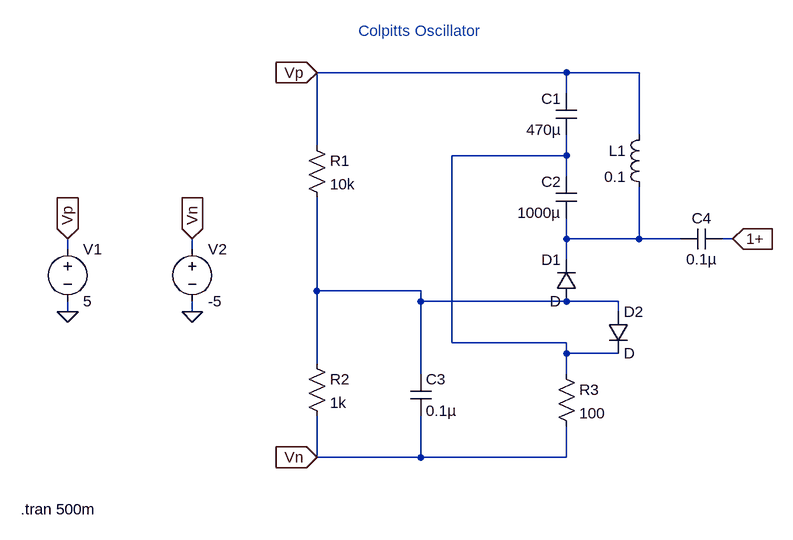
[diagram p0: schematic colpitts_osc_ltspice.asc]
colpitts_osc_ltspice.asc, the LTspice schematic file:
Version 4
SHEET 1 880 784
WIRE -208 -288 -592 -288
WIRE -96 -288 -208 -288
WIRE -208 -256 -208 -288
WIRE -96 -192 -96 -288
WIRE -592 -176 -592 -288
WIRE -208 -160 -208 -192
WIRE -208 -160 -384 -160
WIRE -208 -128 -208 -160
WIRE -208 -32 -208 -64
WIRE -96 -32 -96 -112
WIRE -96 -32 -208 -32
WIRE -32 -32 -96 -32
WIRE 48 -32 32 -32
WIRE -976 -16 -976 -32
WIRE -784 -16 -784 -32
WIRE -208 0 -208 -32
WIRE -592 48 -592 -96
WIRE -432 48 -592 48
WIRE -432 64 -432 48
WIRE -208 64 -432 64
WIRE -128 64 -208 64
WIRE -976 80 -976 64
WIRE -784 80 -784 64
WIRE -128 80 -128 64
WIRE -384 128 -384 -160
WIRE -208 128 -384 128
WIRE -208 144 -208 128
WIRE -128 144 -208 144
WIRE -592 160 -592 48
WIRE -432 176 -432 64
WIRE -208 176 -208 144
WIRE -592 304 -592 240
WIRE -432 304 -432 240
WIRE -432 304 -592 304
WIRE -208 304 -208 256
WIRE -208 304 -432 304
FLAG 48 -32 1+
IOPIN 48 -32 In
FLAG -592 -288 Vp
IOPIN -592 -288 In
FLAG -592 304 Vn
IOPIN -592 304 In
FLAG -976 80 0
FLAG -784 80 0
FLAG -976 -32 Vp
IOPIN -976 -32 In
FLAG -784 -32 Vn
IOPIN -784 -32 In
SYMBOL res -608 -192 R0
SYMATTR InstName R1
SYMATTR Value 10k
SYMBOL res -608 144 R0
SYMATTR InstName R2
SYMATTR Value 1k
SYMBOL res -224 160 R0
SYMATTR InstName R3
SYMATTR Value 100
SYMBOL cap -448 176 R0
SYMATTR InstName C3
SYMATTR Value 0.1µ
SYMBOL cap 32 -48 R90
WINDOW 0 0 32 VBottom 2
WINDOW 3 32 32 VTop 2
SYMATTR InstName C4
SYMATTR Value 0.1µ
SYMBOL voltage -976 -32 R0
WINDOW 123 0 0 Left 0
WINDOW 39 0 0 Left 0
SYMATTR InstName V1
SYMATTR Value 5
SYMBOL voltage -784 -32 R0
WINDOW 123 0 0 Left 0
WINDOW 39 0 0 Left 0
SYMATTR InstName V2
SYMATTR Value -5
SYMBOL cap -192 -256 M0
SYMATTR InstName C1
SYMATTR Value 470µ
SYMBOL cap -192 -128 M0
SYMATTR InstName C2
SYMATTR Value 1000µ
SYMBOL ind -80 -208 M0
SYMATTR InstName L1
SYMATTR Value 0.1
SYMBOL diode -192 64 R180
WINDOW 0 24 64 Left 2
WINDOW 3 24 0 Left 2
SYMATTR InstName D1
SYMBOL diode -144 80 R0
SYMATTR InstName D2
TEXT -528 -352 Left 2 ;Colpitts Oscillator
TEXT -1048 384 Left 2 !.tran 500m

The netlist it stands for:
* colpitts_osc_ltspice.asc
R1 Vp N003 10k
R2 N003 Vn 1k
R3 N001 Vn 100
C3 N003 Vn 0.1µ
C4 1+ N002 0.1µ
V1 Vp 0 5
V2 Vn 0 -5
C1 Vp N001 470µ
C2 N001 N002 1000µ
L1 Vp N002 0.1
D1 N003 N002 D
D2 N003 N001 D
.model D D
.lib standard.dio
* Colpitts Oscillator
.tran 500m
.backanno
.end